# EAGLE schematic A10-OLinuXino-Lime_Rev-B_SHIELD_TEMPLATE (EAGLE 6.2)
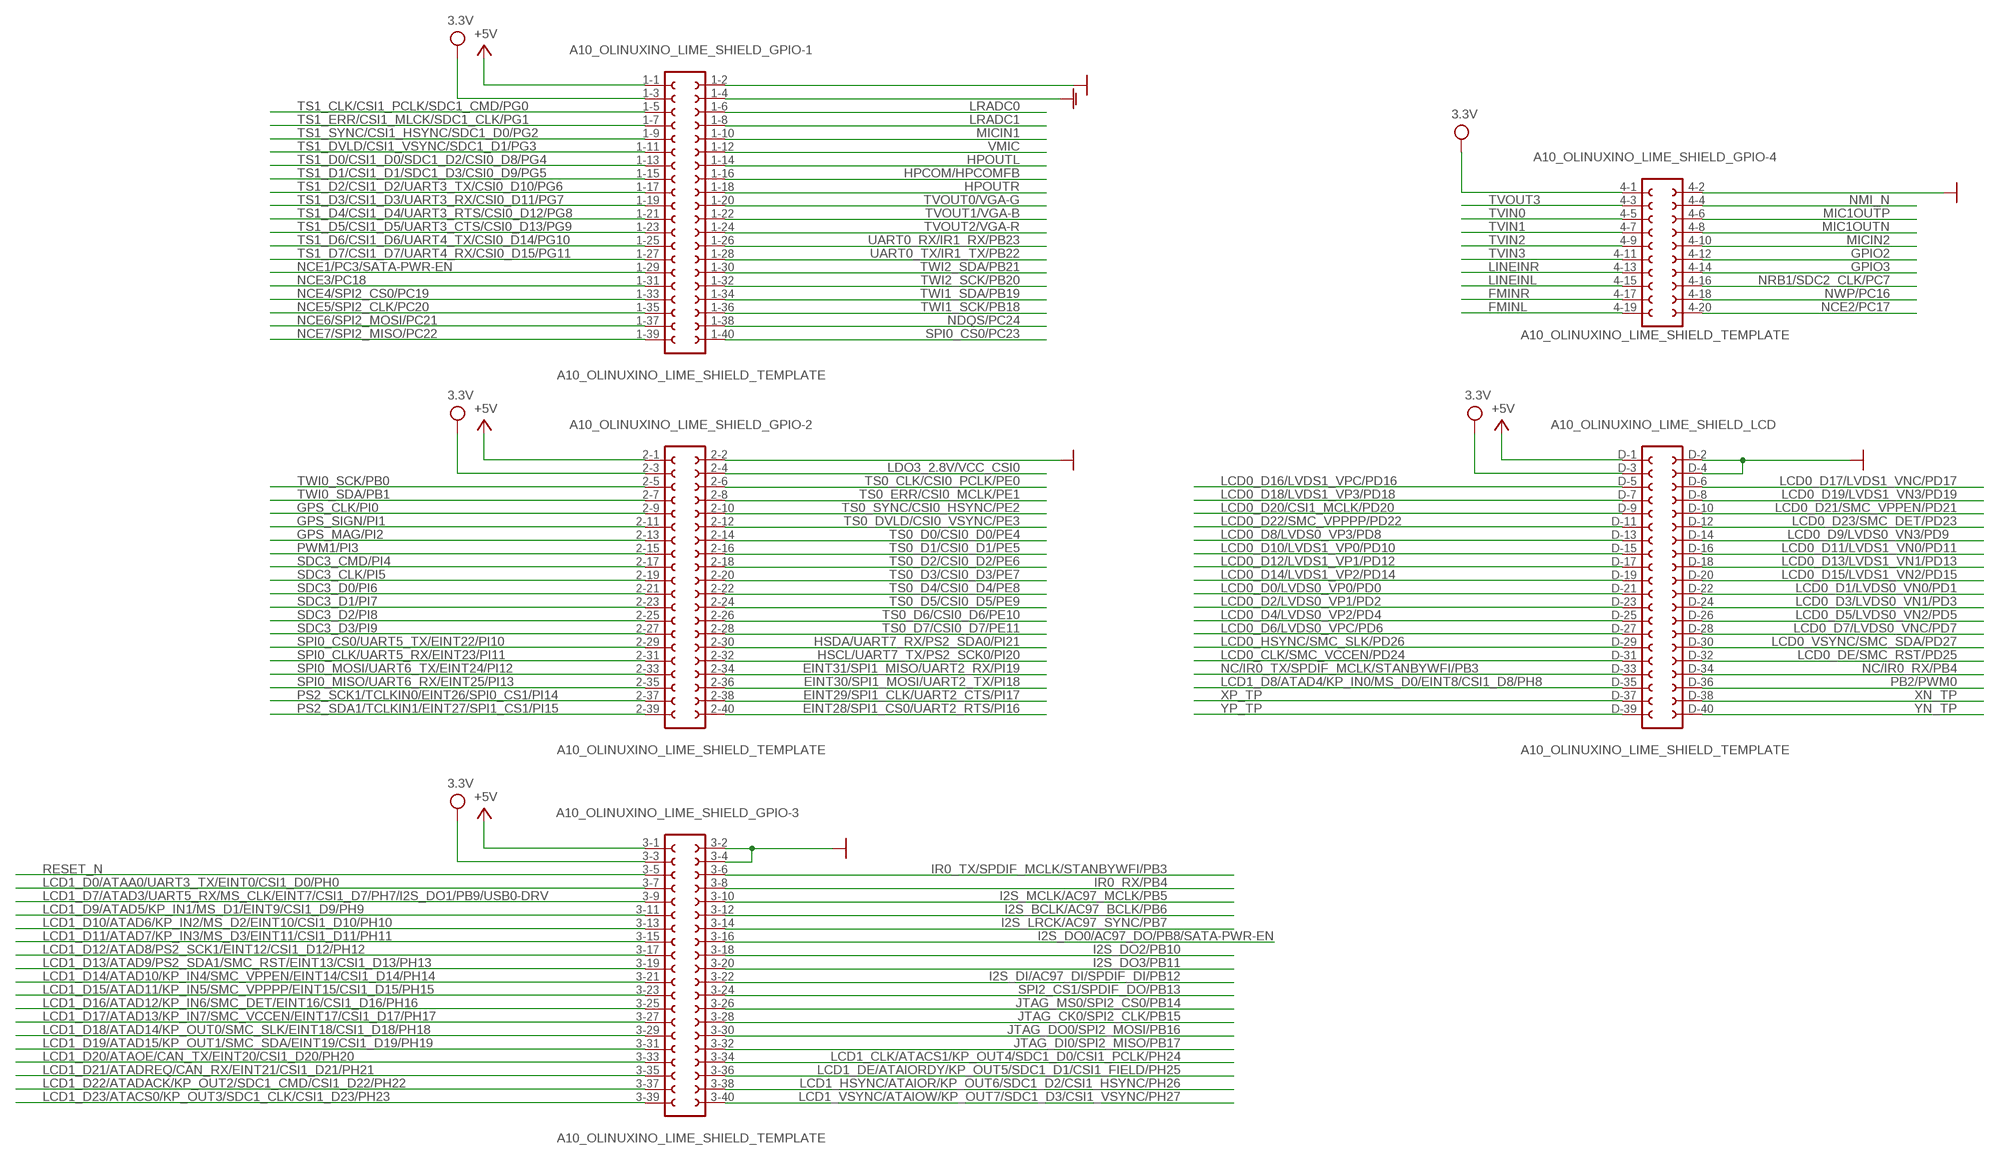
[diagram p0: schematic, sheet 1]

## Parts
A10_OLINUXINO_LIME_SHIELD  A10_OLINUXINO_LIME_SHIELD_TEMPLATE  [A10_OLINUXINO_LIME_SHIELD]

## Nets
+5V: A10_OLINUXINO_LIME_SHIELD.1-1 A10_OLINUXINO_LIME_SHIELD.2-1 A10_OLINUXINO_LIME_SHIELD.3-1 A10_OLINUXINO_LIME_SHIELD.D-1
EINT28/SPI1_CS0/UART2_RTS/PI16: A10_OLINUXINO_LIME_SHIELD.2-40
EINT29/SPI1_CLK/UART2_CTS/PI17: A10_OLINUXINO_LIME_SHIELD.2-38
EINT30/SPI1_MOSI/UART2_TX/PI18: A10_OLINUXINO_LIME_SHIELD.2-36
EINT31/SPI1_MISO/UART2_RX/PI19: A10_OLINUXINO_LIME_SHIELD.2-34
FMINL: A10_OLINUXINO_LIME_SHIELD.4-19
FMINR: A10_OLINUXINO_LIME_SHIELD.4-17
GND: A10_OLINUXINO_LIME_SHIELD.1-2 A10_OLINUXINO_LIME_SHIELD.2-2 A10_OLINUXINO_LIME_SHIELD.3-2 A10_OLINUXINO_LIME_SHIELD.3-4 A10_OLINUXINO_LIME_SHIELD.4-2 A10_OLINUXINO_LIME_SHIELD.D-2 A10_OLINUXINO_LIME_SHIELD.D-4
GNDA: A10_OLINUXINO_LIME_SHIELD.1-4
GPIO2: A10_OLINUXINO_LIME_SHIELD.4-12
GPIO3: A10_OLINUXINO_LIME_SHIELD.4-14
GPS_CLK/PI0: A10_OLINUXINO_LIME_SHIELD.2-9
GPS_MAG/PI2: A10_OLINUXINO_LIME_SHIELD.2-13
GPS_SIGN/PI1: A10_OLINUXINO_LIME_SHIELD.2-11
HPCOM/HPCOMFB: A10_OLINUXINO_LIME_SHIELD.1-16
HPOUTL: A10_OLINUXINO_LIME_SHIELD.1-14
HPOUTR: A10_OLINUXINO_LIME_SHIELD.1-18
HSCL/UART7_TX/PS2_SCK0/PI20: A10_OLINUXINO_LIME_SHIELD.2-32
HSDA/UART7_RX/PS2_SDA0/PI21: A10_OLINUXINO_LIME_SHIELD.2-30
I2S_BCLK/AC97_BCLK/PB6: A10_OLINUXINO_LIME_SHIELD.3-12
I2S_DI/AC97_DI/SPDIF_DI/PB12: A10_OLINUXINO_LIME_SHIELD.3-22
I2S_DO0/AC97_DO/PB8/SATA-PWR-EN: A10_OLINUXINO_LIME_SHIELD.3-16
I2S_DO2/PB10: A10_OLINUXINO_LIME_SHIELD.3-18
I2S_DO3/PB11: A10_OLINUXINO_LIME_SHIELD.3-20
I2S_LRCK/AC97_SYNC/PB7: A10_OLINUXINO_LIME_SHIELD.3-14
I2S_MCLK/AC97_MCLK/PB5: A10_OLINUXINO_LIME_SHIELD.3-10
IR0_RX/PB4: A10_OLINUXINO_LIME_SHIELD.3-8
IR0_TX/SPDIF_MCLK/STANBYWFI/PB3: A10_OLINUXINO_LIME_SHIELD.3-6
JTAG_CK0/SPI2_CLK/PB15: A10_OLINUXINO_LIME_SHIELD.3-28
JTAG_DI0/SPI2_MISO/PB17: A10_OLINUXINO_LIME_SHIELD.3-32
JTAG_DO0/SPI2_MOSI/PB16: A10_OLINUXINO_LIME_SHIELD.3-30
JTAG_MS0/SPI2_CS0/PB14: A10_OLINUXINO_LIME_SHIELD.3-26
LCD0_CLK/SMC_VCCEN/PD24: A10_OLINUXINO_LIME_SHIELD.D-31
LCD0_D0/LVDS0_VP0/PD0: A10_OLINUXINO_LIME_SHIELD.D-21
LCD0_D1/LVDS0_VN0/PD1: A10_OLINUXINO_LIME_SHIELD.D-22
LCD0_D2/LVDS0_VP1/PD2: A10_OLINUXINO_LIME_SHIELD.D-23
LCD0_D3/LVDS0_VN1/PD3: A10_OLINUXINO_LIME_SHIELD.D-24
LCD0_D4/LVDS0_VP2/PD4: A10_OLINUXINO_LIME_SHIELD.D-25
LCD0_D5/LVDS0_VN2/PD5: A10_OLINUXINO_LIME_SHIELD.D-26
LCD0_D6/LVDS0_VPC/PD6: A10_OLINUXINO_LIME_SHIELD.D-27
LCD0_D7/LVDS0_VNC/PD7: A10_OLINUXINO_LIME_SHIELD.D-28
LCD0_D8/LVDS0_VP3/PD8: A10_OLINUXINO_LIME_SHIELD.D-13
LCD0_D9/LVDS0_VN3/PD9: A10_OLINUXINO_LIME_SHIELD.D-14
LCD0_D10/LVDS1_VP0/PD10: A10_OLINUXINO_LIME_SHIELD.D-15
LCD0_D11/LVDS1_VN0/PD11: A10_OLINUXINO_LIME_SHIELD.D-16
LCD0_D12/LVDS1_VP1/PD12: A10_OLINUXINO_LIME_SHIELD.D-17
LCD0_D13/LVDS1_VN1/PD13: A10_OLINUXINO_LIME_SHIELD.D-18
LCD0_D14/LVDS1_VP2/PD14: A10_OLINUXINO_LIME_SHIELD.D-19
LCD0_D15/LVDS1_VN2/PD15: A10_OLINUXINO_LIME_SHIELD.D-20
LCD0_D16/LVDS1_VPC/PD16: A10_OLINUXINO_LIME_SHIELD.D-5
LCD0_D17/LVDS1_VNC/PD17: A10_OLINUXINO_LIME_SHIELD.D-6
LCD0_D18/LVDS1_VP3/PD18: A10_OLINUXINO_LIME_SHIELD.D-7
LCD0_D19/LVDS1_VN3/PD19: A10_OLINUXINO_LIME_SHIELD.D-8
LCD0_D20/CSI1_MCLK/PD20: A10_OLINUXINO_LIME_SHIELD.D-9
LCD0_D21/SMC_VPPEN/PD21: A10_OLINUXINO_LIME_SHIELD.D-10
LCD0_D22/SMC_VPPPP/PD22: A10_OLINUXINO_LIME_SHIELD.D-11
LCD0_D23/SMC_DET/PD23: A10_OLINUXINO_LIME_SHIELD.D-12
LCD0_DE/SMC_RST/PD25: A10_OLINUXINO_LIME_SHIELD.D-32
LCD0_HSYNC/SMC_SLK/PD26: A10_OLINUXINO_LIME_SHIELD.D-29
LCD0_VSYNC/SMC_SDA/PD27: A10_OLINUXINO_LIME_SHIELD.D-30
LCD1_CLK/ATACS1/KP_OUT4/SDC1_D0/CSI1_PCLK/PH24: A10_OLINUXINO_LIME_SHIELD.3-34
LCD1_D0/ATAA0/UART3_TX/EINT0/CSI1_D0/PH0: A10_OLINUXINO_LIME_SHIELD.3-7
LCD1_D7/ATAD3/UART5_RX/MS_CLK/EINT7/CSI1_D7/PH7/I2S_DO1/PB9/USB0-DRV: A10_OLINUXINO_LIME_SHIELD.3-9
LCD1_D8/ATAD4/KP_IN0/MS_D0/EINT8/CSI1_D8/PH8: A10_OLINUXINO_LIME_SHIELD.D-35
LCD1_D9/ATAD5/KP_IN1/MS_D1/EINT9/CSI1_D9/PH9: A10_OLINUXINO_LIME_SHIELD.3-11
LCD1_D10/ATAD6/KP_IN2/MS_D2/EINT10/CSI1_D10/PH10: A10_OLINUXINO_LIME_SHIELD.3-13
LCD1_D11/ATAD7/KP_IN3/MS_D3/EINT11/CSI1_D11/PH11: A10_OLINUXINO_LIME_SHIELD.3-15
LCD1_D12/ATAD8/PS2_SCK1/EINT12/CSI1_D12/PH12: A10_OLINUXINO_LIME_SHIELD.3-17
LCD1_D13/ATAD9/PS2_SDA1/SMC_RST/EINT13/CSI1_D13/PH13: A10_OLINUXINO_LIME_SHIELD.3-19
LCD1_D14/ATAD10/KP_IN4/SMC_VPPEN/EINT14/CSI1_D14/PH14: A10_OLINUXINO_LIME_SHIELD.3-21
LCD1_D15/ATAD11/KP_IN5/SMC_VPPPP/EINT15/CSI1_D15/PH15: A10_OLINUXINO_LIME_SHIELD.3-23
LCD1_D16/ATAD12/KP_IN6/SMC_DET/EINT16/CSI1_D16/PH16: A10_OLINUXINO_LIME_SHIELD.3-25
LCD1_D17/ATAD13/KP_IN7/SMC_VCCEN/EINT17/CSI1_D17/PH17: A10_OLINUXINO_LIME_SHIELD.3-27
LCD1_D18/ATAD14/KP_OUT0/SMC_SLK/EINT18/CSI1_D18/PH18: A10_OLINUXINO_LIME_SHIELD.3-29
LCD1_D19/ATAD15/KP_OUT1/SMC_SDA/EINT19/CSI1_D19/PH19: A10_OLINUXINO_LIME_SHIELD.3-31
LCD1_D20/ATAOE/CAN_TX/EINT20/CSI1_D20/PH20: A10_OLINUXINO_LIME_SHIELD.3-33
LCD1_D21/ATADREQ/CAN_RX/EINT21/CSI1_D21/PH21: A10_OLINUXINO_LIME_SHIELD.3-35
LCD1_D22/ATADACK/KP_OUT2/SDC1_CMD/CSI1_D22/PH22: A10_OLINUXINO_LIME_SHIELD.3-37
LCD1_D23/ATACS0/KP_OUT3/SDC1_CLK/CSI1_D23/PH23: A10_OLINUXINO_LIME_SHIELD.3-39
LCD1_DE/ATAIORDY/KP_OUT5/SDC1_D1/CSI1_FIELD/PH25: A10_OLINUXINO_LIME_SHIELD.3-36
LCD1_HSYNC/ATAIOR/KP_OUT6/SDC1_D2/CSI1_HSYNC/PH26: A10_OLINUXINO_LIME_SHIELD.3-38
LCD1_VSYNC/ATAIOW/KP_OUT7/SDC1_D3/CSI1_VSYNC/PH27: A10_OLINUXINO_LIME_SHIELD.3-40
LDO3_2.8V/VCC_CSI0: A10_OLINUXINO_LIME_SHIELD.2-4
LINEINL: A10_OLINUXINO_LIME_SHIELD.4-15
LINEINR: A10_OLINUXINO_LIME_SHIELD.4-13
LRADC0: A10_OLINUXINO_LIME_SHIELD.1-6
LRADC1: A10_OLINUXINO_LIME_SHIELD.1-8
MIC1OUTN: A10_OLINUXINO_LIME_SHIELD.4-8
MIC1OUTP: A10_OLINUXINO_LIME_SHIELD.4-6
MICIN1: A10_OLINUXINO_LIME_SHIELD.1-10
MICIN2: A10_OLINUXINO_LIME_SHIELD.4-10
NC/IR0_RX/PB4: A10_OLINUXINO_LIME_SHIELD.D-34
NC/IR0_TX/SPDIF_MCLK/STANBYWFI/PB3: A10_OLINUXINO_LIME_SHIELD.D-33
NCE1/PC3/SATA-PWR-EN: A10_OLINUXINO_LIME_SHIELD.1-29
NCE2/PC17: A10_OLINUXINO_LIME_SHIELD.4-20
NCE3/PC18: A10_OLINUXINO_LIME_SHIELD.1-31
NCE4/SPI2_CS0/PC19: A10_OLINUXINO_LIME_SHIELD.1-33
NCE5/SPI2_CLK/PC20: A10_OLINUXINO_LIME_SHIELD.1-35
NCE6/SPI2_MOSI/PC21: A10_OLINUXINO_LIME_SHIELD.1-37
NCE7/SPI2_MISO/PC22: A10_OLINUXINO_LIME_SHIELD.1-39
NDQS/PC24: A10_OLINUXINO_LIME_SHIELD.1-38
NMI_N: A10_OLINUXINO_LIME_SHIELD.4-4
NRB1/SDC2_CLK/PC7: A10_OLINUXINO_LIME_SHIELD.4-16
NWP/PC16: A10_OLINUXINO_LIME_SHIELD.4-18
PB2/PWM0: A10_OLINUXINO_LIME_SHIELD.D-36
PS2_SCK1/TCLKIN0/EINT26/SPI0_CS1/PI14: A10_OLINUXINO_LIME_SHIELD.2-37
PS2_SDA1/TCLKIN1/EINT27/SPI1_CS1/PI15: A10_OLINUXINO_LIME_SHIELD.2-39
PWM1/PI3: A10_OLINUXINO_LIME_SHIELD.2-15
RESET_N: A10_OLINUXINO_LIME_SHIELD.3-5
SDC3_CLK/PI5: A10_OLINUXINO_LIME_SHIELD.2-19
SDC3_CMD/PI4: A10_OLINUXINO_LIME_SHIELD.2-17
SDC3_D0/PI6: A10_OLINUXINO_LIME_SHIELD.2-21
SDC3_D1/PI7: A10_OLINUXINO_LIME_SHIELD.2-23
SDC3_D2/PI8: A10_OLINUXINO_LIME_SHIELD.2-25
SDC3_D3/PI9: A10_OLINUXINO_LIME_SHIELD.2-27
SPI0_CLK/UART5_RX/EINT23/PI11: A10_OLINUXINO_LIME_SHIELD.2-31
SPI0_CS0/PC23: A10_OLINUXINO_LIME_SHIELD.1-40
SPI0_CS0/UART5_TX/EINT22/PI10: A10_OLINUXINO_LIME_SHIELD.2-29
SPI0_MISO/UART6_RX/EINT25/PI13: A10_OLINUXINO_LIME_SHIELD.2-35
SPI0_MOSI/UART6_TX/EINT24/PI12: A10_OLINUXINO_LIME_SHIELD.2-33
SPI2_CS1/SPDIF_DO/PB13: A10_OLINUXINO_LIME_SHIELD.3-24
TS0_CLK/CSI0_PCLK/PE0: A10_OLINUXINO_LIME_SHIELD.2-6
TS0_D0/CSI0_D0/PE4: A10_OLINUXINO_LIME_SHIELD.2-14
TS0_D1/CSI0_D1/PE5: A10_OLINUXINO_LIME_SHIELD.2-16
TS0_D2/CSI0_D2/PE6: A10_OLINUXINO_LIME_SHIELD.2-18
TS0_D3/CSI0_D3/PE7: A10_OLINUXINO_LIME_SHIELD.2-20
TS0_D4/CSI0_D4/PE8: A10_OLINUXINO_LIME_SHIELD.2-22
TS0_D5/CSI0_D5/PE9: A10_OLINUXINO_LIME_SHIELD.2-24
TS0_D6/CSI0_D6/PE10: A10_OLINUXINO_LIME_SHIELD.2-26
TS0_D7/CSI0_D7/PE11: A10_OLINUXINO_LIME_SHIELD.2-28
TS0_DVLD/CSI0_VSYNC/PE3: A10_OLINUXINO_LIME_SHIELD.2-12
TS0_ERR/CSI0_MCLK/PE1: A10_OLINUXINO_LIME_SHIELD.2-8
TS0_SYNC/CSI0_HSYNC/PE2: A10_OLINUXINO_LIME_SHIELD.2-10
TS1_CLK/CSI1_PCLK/SDC1_CMD/PG0: A10_OLINUXINO_LIME_SHIELD.1-5
TS1_D0/CSI1_D0/SDC1_D2/CSI0_D8/PG4: A10_OLINUXINO_LIME_SHIELD.1-13
TS1_D1/CSI1_D1/SDC1_D3/CSI0_D9/PG5: A10_OLINUXINO_LIME_SHIELD.1-15
TS1_D2/CSI1_D2/UART3_TX/CSI0_D10/PG6: A10_OLINUXINO_LIME_SHIELD.1-17
TS1_D3/CSI1_D3/UART3_RX/CSI0_D11/PG7: A10_OLINUXINO_LIME_SHIELD.1-19
TS1_D4/CSI1_D4/UART3_RTS/CSI0_D12/PG8: A10_OLINUXINO_LIME_SHIELD.1-21
TS1_D5/CSI1_D5/UART3_CTS/CSI0_D13/PG9: A10_OLINUXINO_LIME_SHIELD.1-23
TS1_D6/CSI1_D6/UART4_TX/CSI0_D14/PG10: A10_OLINUXINO_LIME_SHIELD.1-25
TS1_D7/CSI1_D7/UART4_RX/CSI0_D15/PG11: A10_OLINUXINO_LIME_SHIELD.1-27
TS1_DVLD/CSI1_VSYNC/SDC1_D1/PG3: A10_OLINUXINO_LIME_SHIELD.1-11
TS1_ERR/CSI1_MLCK/SDC1_CLK/PG1: A10_OLINUXINO_LIME_SHIELD.1-7
TS1_SYNC/CSI1_HSYNC/SDC1_D0/PG2: A10_OLINUXINO_LIME_SHIELD.1-9
TVIN0: A10_OLINUXINO_LIME_SHIELD.4-5
TVIN1: A10_OLINUXINO_LIME_SHIELD.4-7
TVIN2: A10_OLINUXINO_LIME_SHIELD.4-9
TVIN3: A10_OLINUXINO_LIME_SHIELD.4-11
TVOUT0/VGA-G: A10_OLINUXINO_LIME_SHIELD.1-20
TVOUT1/VGA-B: A10_OLINUXINO_LIME_SHIELD.1-22
TVOUT2/VGA-R: A10_OLINUXINO_LIME_SHIELD.1-24
TVOUT3: A10_OLINUXINO_LIME_SHIELD.4-3
TWI0_SCK/PB0: A10_OLINUXINO_LIME_SHIELD.2-5
TWI0_SDA/PB1: A10_OLINUXINO_LIME_SHIELD.2-7
TWI1_SCK/PB18: A10_OLINUXINO_LIME_SHIELD.1-36
TWI1_SDA/PB19: A10_OLINUXINO_LIME_SHIELD.1-34
TWI2_SCK/PB20: A10_OLINUXINO_LIME_SHIELD.1-32
TWI2_SDA/PB21: A10_OLINUXINO_LIME_SHIELD.1-30
UART0_RX/IR1_RX/PB23: A10_OLINUXINO_LIME_SHIELD.1-26
UART0_TX/IR1_TX/PB22: A10_OLINUXINO_LIME_SHIELD.1-28
VCC: A10_OLINUXINO_LIME_SHIELD.1-3 A10_OLINUXINO_LIME_SHIELD.2-3 A10_OLINUXINO_LIME_SHIELD.3-3 A10_OLINUXINO_LIME_SHIELD.4-1 A10_OLINUXINO_LIME_SHIELD.D-3 ; supply symbol labelled 3.3V
VMIC: A10_OLINUXINO_LIME_SHIELD.1-12
XN_TP: A10_OLINUXINO_LIME_SHIELD.D-38
XP_TP: A10_OLINUXINO_LIME_SHIELD.D-37
YN_TP: A10_OLINUXINO_LIME_SHIELD.D-40
YP_TP: A10_OLINUXINO_LIME_SHIELD.D-39

## Library data of the parts
A10_OLINUXINO_LIME_SHIELD = A10_OLIMEXINO_LIME_SHIELD:A10_OLINUXINO_LIME_SHIELD_TEMPLATE